# EAGLE design right_revision1_0 (EAGLE 7.2.0)
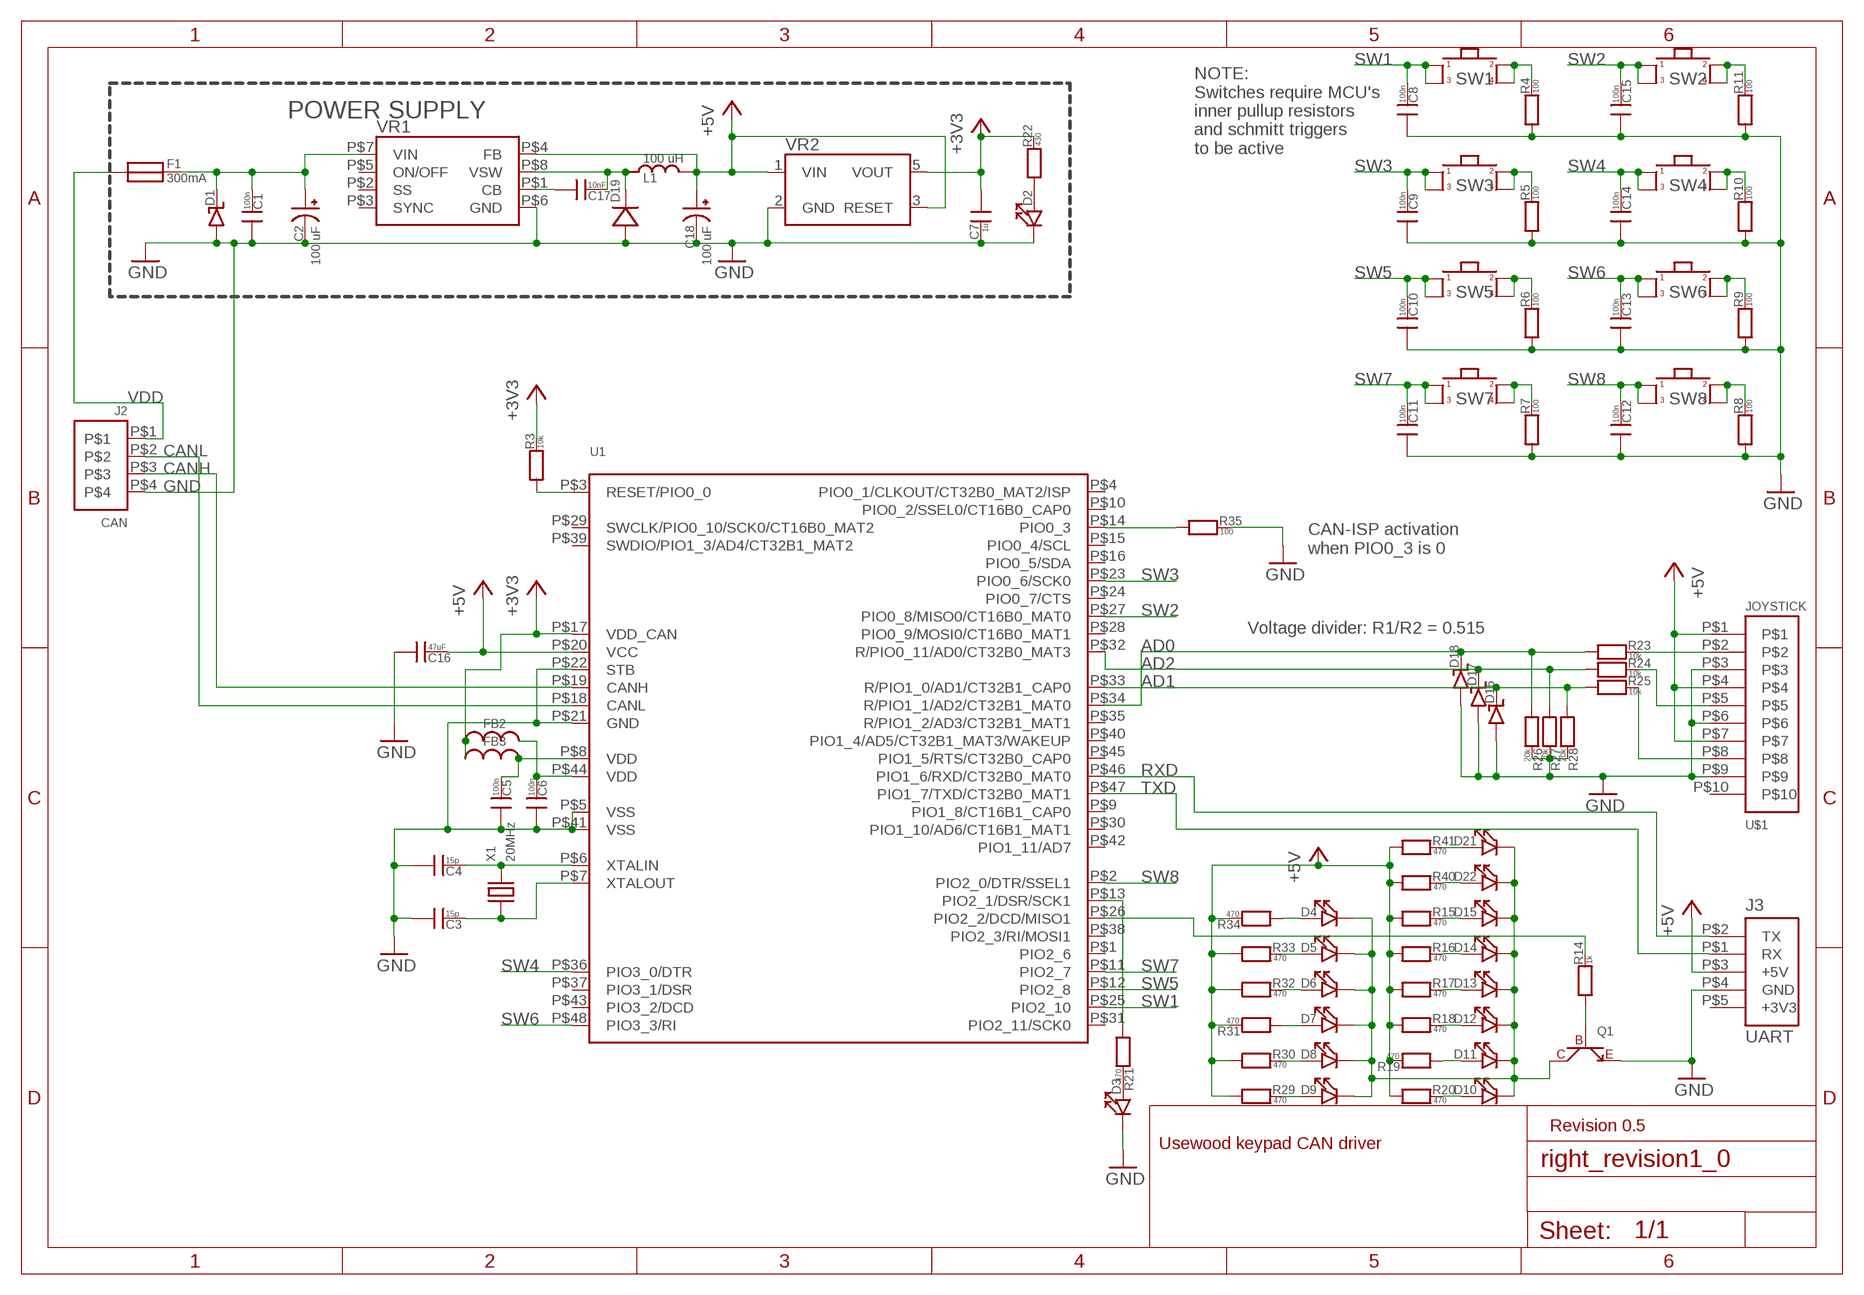
[diagram p0: schematic, sheet 1]

## Parts
C1  100n  CAP0603_SILKSCREEN  [0603_SILKSCREEN]
C2  100 uF  CAP_POLSMD_10X10X10MM  [CAP_POL_SMD_10X10X10MM]
C3  15p  CAP0603_SILKSCREEN  [0603_SILKSCREEN]
C4  15p  CAP0603_SILKSCREEN  [0603_SILKSCREEN]
C5  100n  CAP0603_SILKSCREEN  [0603_SILKSCREEN]
C6  100n  CAP0603_SILKSCREEN  [0603_SILKSCREEN]
C7  1u  CAP0603_SILKSCREEN  [0603_SILKSCREEN]
C8  100n  CAP0603_SILKSCREEN  [0603_SILKSCREEN]
C9  100n  CAP0603_SILKSCREEN  [0603_SILKSCREEN]
C10  100n  CAP0603_SILKSCREEN  [0603_SILKSCREEN]
C11  100n  CAP0603_SILKSCREEN  [0603_SILKSCREEN]
C12  100n  CAP0603_SILKSCREEN  [0603_SILKSCREEN]
C13  100n  CAP0603_SILKSCREEN  [0603_SILKSCREEN]
C14  100n  CAP0603_SILKSCREEN  [0603_SILKSCREEN]
C15  100n  CAP0603_SILKSCREEN  [0603_SILKSCREEN]
C16  47uF  CAP0603_SILKSCREEN  [0603_SILKSCREEN]
C17  10nF  CAP0603_SILKSCREEN  [0603_SILKSCREEN]
C18  100 uF  CAP_POLSMD_10X10X10MM  [CAP_POL_SMD_10X10X10MM]
D1  DIODE_TVSDO-214AA  [DO-214AB]
D2  LED0603_SILKSCREEN  [0603_SILKSCREEN]
D3  LED0603_SILKSCREEN  [0603_SILKSCREEN]
D4  LED0603_SILKSCREEN  [0603_SILKSCREEN]
D5  LED0603_SILKSCREEN  [0603_SILKSCREEN]
D6  LED0603_SILKSCREEN  [0603_SILKSCREEN]
D7  LED0603_SILKSCREEN  [0603_SILKSCREEN]
D8  LED0603_SILKSCREEN  [0603_SILKSCREEN]
D9  LED0603_SILKSCREEN  [0603_SILKSCREEN]
D10  LED0603_SILKSCREEN  [0603_SILKSCREEN]
D11  LED0603_SILKSCREEN  [0603_SILKSCREEN]
D12  LED0603_SILKSCREEN  [0603_SILKSCREEN]
D13  LED0603_SILKSCREEN  [0603_SILKSCREEN]
D14  LED0603_SILKSCREEN  [0603_SILKSCREEN]
D15  LED0603_SILKSCREEN  [0603_SILKSCREEN]
D16  DIODE_ZENERSDO123  [SOD123]
D17  DIODE_ZENERSDO123  [SOD123]
D18  DIODE_ZENERSDO123  [SOD123]
D19  DIODEDO219AB  [DO219AB]
D21  LED0603_SILKSCREEN  [0603_SILKSCREEN]
D22  LED0603_SILKSCREEN  [0603_SILKSCREEN]
F1  300mA  FUSE100MA  [FUSE_100MA]
FB2  FERRITE0603_SILKSCREEN  [0603_SILKSCREEN]
FB3  FERRITE0603_SILKSCREEN  [0603_SILKSCREEN]
J2  CAN  MOLEX_MICRO-FIT_4WAYTH  [MOLEX_MICRO-FIT_4WAY]
J3  UART  HEADER_USARTTH  [HEADER5_1]
L1  100 uH  INDUCTORBOURNS_10X13X5MM  [INDUCTOR_BOURNS_10X13X5MM]
Q1  NPN_TRANSISTORSOT323  [SOT323]
R3  10k  RES0604_SILKSCREEN  [0603_SILKSCREEN]
R4  100  RES0604_SILKSCREEN  [0603_SILKSCREEN]
R5  100  RES0604_SILKSCREEN  [0603_SILKSCREEN]
R6  100  RES0604_SILKSCREEN  [0603_SILKSCREEN]
R7  100  RES0604_SILKSCREEN  [0603_SILKSCREEN]
R8  100  RES0604_SILKSCREEN  [0603_SILKSCREEN]
R9  100  RES0604_SILKSCREEN  [0603_SILKSCREEN]
R10  100  RES0604_SILKSCREEN  [0603_SILKSCREEN]
R11  100  RES0604_SILKSCREEN  [0603_SILKSCREEN]
R14  1k  RES0604_SILKSCREEN  [0603_SILKSCREEN]
R15  470  RES0604_SILKSCREEN  [0603_SILKSCREEN]
R16  470  RES0604_SILKSCREEN  [0603_SILKSCREEN]
R17  470  RES0604_SILKSCREEN  [0603_SILKSCREEN]
R18  470  RES0604_SILKSCREEN  [0603_SILKSCREEN]
R19  470  RES0604_SILKSCREEN  [0603_SILKSCREEN]
R20  470  RES0604_SILKSCREEN  [0603_SILKSCREEN]
R21  470  RES0604_SILKSCREEN  [0603_SILKSCREEN]
R22  430  RES0604_SILKSCREEN  [0603_SILKSCREEN]
R23  10k  RES0604_SILKSCREEN  [0603_SILKSCREEN]
R24  10k  RES0604_SILKSCREEN  [0603_SILKSCREEN]
R25  10k  RES0604_SILKSCREEN  [0603_SILKSCREEN]
R26  20k  RES0604_SILKSCREEN  [0603_SILKSCREEN]
R27  20k  RES0604_SILKSCREEN  [0603_SILKSCREEN]
R28  20k  RES0604_SILKSCREEN  [0603_SILKSCREEN]
R29  470  RES0604_SILKSCREEN  [0603_SILKSCREEN]
R30  470  RES0604_SILKSCREEN  [0603_SILKSCREEN]
R31  470  RES0604_SILKSCREEN  [0603_SILKSCREEN]
R32  470  RES0604_SILKSCREEN  [0603_SILKSCREEN]
R33  470  RES0604_SILKSCREEN  [0603_SILKSCREEN]
R34  470  RES0604_SILKSCREEN  [0603_SILKSCREEN]
R35  100  RES0604_SILKSCREEN  [0603_SILKSCREEN]
R40  470  RES0604_SILKSCREEN  [0603_SILKSCREEN]
R41  470  RES0604_SILKSCREEN  [0603_SILKSCREEN]
SW1  SWITCH12X12MM_CENTER_HOLE  [SWITCH_12X12MM_CENTER_HOLE]
SW2  SWITCH12X12MM_CENTER_HOLE  [SWITCH_12X12MM_CENTER_HOLE]
SW3  SWITCH12X12MM_CENTER_HOLE  [SWITCH_12X12MM_CENTER_HOLE]
SW4  SWITCH12X12MM_CENTER_HOLE  [SWITCH_12X12MM_CENTER_HOLE]
SW5  SWITCH12X12MM_CENTER_HOLE  [SWITCH_12X12MM_CENTER_HOLE]
SW6  SWITCH12X12MM_CENTER_HOLE  [SWITCH_12X12MM_CENTER_HOLE]
SW7  SWITCH12X12MM_CENTER_HOLE  [SWITCH_12X12MM_CENTER_HOLE]
SW8  SWITCH12X12MM_CENTER_HOLE  [SWITCH_12X12MM_CENTER_HOLE]
U1  LPC11C22QFP48  [QFP48]
U$1  JOYSTICK  MOLEX_MICRO-FIT_10WAYTH  [MOLEX-MICRO-FIT_10WAY]
VR1  LM2671SOIC8  [SOIC8]
VR2  LP2985SOP5  [SOP5]
X1  20MHz  XTALSMD_5X3.2  [XTAL_SMD_5X3.2]

## Nets
+3V3: C7.0 FB2.0 FB3.0 R3.1 R22.1 U1.P$17(VDD_CAN) VR2.5(VOUT)
+5V: C16.1 C18.+ J3.P$3(+5V) L1.P$2 R15.0 R16.0 R17.0 R18.0 R19.1 R20.0 R29.0 R30.0 R31.1 R32.0 R33.0 R34.1 R40.0 R41.0 U1.P$20(VCC) U$1.P$1 U$1.P$4 U$1.P$7 VR1.P$4(FB) VR2.1(VIN) VR2.3(RESET)
AD0: D18.P$2(N) R23.0 R26.0 U1.P$34(R/PIO1_1/AD2/CT32B1_MAT0)
AD1: D16.P$2(N) R25.0 R28.0 U1.P$33(R/PIO1_0/AD1/CT32B1_CAP0)
AD2: D17.P$2(N) R24.0 R27.0 U1.P$32(R/PIO0_11/AD0/CT32B0_MAT3)
CAN_ISP: R35.0 U1.P$14(PIO0_3)
CANH: J2.P$3 U1.P$19(CANH)
CANL: J2.P$2 U1.P$18(CANL)
GND: C1.0 C2.- C3.0 C4.0 C5.0 C6.0 C7.1 C8.0 C9.0 C10.0 C11.0 C12.0 C13.0 C14.0 C15.0 C16.0 C18.- D1.P$1(P) D2.1 D3.1 D16.P$1(P) D17.P$1(P) D18.P$1(P) D19.P$1(P) J2.P$4 J3.P$4(GND) Q1.R(E) R4.0 R5.0 R6.0 R7.0 R8.0 R9.0 R10.0 R11.0 R26.1 R27.1 R28.1 R35.1 U1.P$5(VSS) U1.P$21(GND) U1.P$22(STB) U1.P$41(VSS) U$1.P$3 U$1.P$6 U$1.P$9 VR1.P$6(GND) VR2.2(GND)
LED3: D3.0 R21.1
LED4: D4.0 R34.0
LED5: D5.0 R33.1
LED6: D6.0 R32.1
LED7: D7.0 R31.0
LED8: D8.0 R30.1
LED9: D9.0 R29.1
N$1: C1.1 C2.+ D1.P$2(N) F1.P$2 VR1.P$7(VIN)
N$2: C6.1 FB2.1 U1.P$44(VDD)
N$3: D2.0 R22.0
N$4: C17.1 D19.P$2(N) L1.P$1 VR1.P$8(VSW)
N$5: R14.1 U1.P$26(PIO2_2/DCD/MISO1)
N$6: R21.0 U1.P$13(PIO2_1/DSR/SCK1)
N$12: R4.1 SW1.P$3 SW1.P$4
N$13: R5.1 SW3.P$3 SW3.P$4
N$14: R6.1 SW5.P$3 SW5.P$4
N$15: R11.1 SW2.P$3 SW2.P$4
N$16: R9.1 SW6.P$3 SW6.P$4
N$17: R10.1 SW4.P$3 SW4.P$4
N$18: R8.1 SW8.P$3 SW8.P$4
N$19: R7.1 SW7.P$3 SW7.P$4
N$20: D15.0 R15.1
N$21: D14.0 R16.1
N$22: D13.0 R17.1
N$23: D12.0 R18.1
N$24: D11.0 R19.0
N$25: D10.0 R20.1
N$26: C5.1 FB3.1 U1.P$8(VDD)
N$27: C17.0 VR1.P$1(CB)
N$29: D21.0 R41.1
N$30: D22.0 R40.1
N$31: D4.1 D5.1 D6.1 D7.1 D8.1 D9.1 D10.1 D11.1 D12.1 D13.1 D14.1 D15.1 D21.1 D22.1 Q1.M(C)
Q1: Q1.L(B) R14.0
RESET: R3.0 U1.P$3(RESET/PIO0_0)
RXD: J3.P$2(TX) U1.P$46(PIO1_6/RXD/CT32B0_MAT0)
SW1: C8.1 SW1.P$1 SW1.P$2 U1.P$25(PIO2_10)
SW2: C15.1 SW2.P$1 SW2.P$2 U1.P$27(PIO0_8/MISO0/CT16B0_MAT0)
SW3: C9.1 SW3.P$1 SW3.P$2 U1.P$23(PIO0_6/SCK0)
SW4: C14.1 SW4.P$1 SW4.P$2 U1.P$36(PIO3_0/DTR)
SW5: C10.1 SW5.P$1 SW5.P$2 U1.P$12(PIO2_8)
SW6: C13.1 SW6.P$1 SW6.P$2 U1.P$48(PIO3_3/RI)
SW7: C11.1 SW7.P$1 SW7.P$2 U1.P$11(PIO2_7)
SW8: C12.1 SW8.P$1 SW8.P$2 U1.P$2(PIO2_0/DTR/SSEL1)
TXD: J3.P$1(RX) U1.P$47(PIO1_7/TXD/CT32B0_MAT1)
VDD: F1.P$1 J2.P$1
XJOY: R23.1 U$1.P$2
XTALIN: C4.1 U1.P$6(XTALIN) X1.P$2
XTALOUT: C3.1 U1.P$7(XTALOUT) X1.P$1
YJOY: R24.1 U$1.P$5
ZJOY: R25.1 U$1.P$8
Unconnected: J3.P$5(+3V3) U1.P$1(PIO2_6) U1.P$4(PIO0_1/CLKOUT/CT32B0_MAT2/ISP) U1.P$9(PIO1_8/CT16B1_CAP0) U1.P$10(PIO0_2/SSEL0/CT16B0_CAP0) U1.P$15(PIO0_4/SCL) U1.P$16(PIO0_5/SDA) U1.P$24(PIO0_7/CTS) U1.P$28(PIO0_9/MOSI0/CT16B0_MAT1) U1.P$29(SWCLK/PIO0_10/SCK0/CT16B0_MAT2) U1.P$30(PIO1_10/AD6/CT16B1_MAT1) U1.P$31(PIO2_11/SCK0) U1.P$35(R/PIO1_2/AD3/CT32B1_MAT1) U1.P$37(PIO3_1/DSR) U1.P$38(PIO2_3/RI/MOSI1) U1.P$39(SWDIO/PIO1_3/AD4/CT32B1_MAT2) U1.P$40(PIO1_4/AD5/CT32B1_MAT3/WAKEUP) U1.P$42(PIO1_11/AD7) U1.P$43(PIO3_2/DCD) U1.P$45(PIO1_5/RTS/CT32B0_CAP0) U$1.P$10 VR1.P$2(SS) VR1.P$3(SYNC) VR1.P$5(ON/OFF)

## Notes on the sheet
- POWER SUPPLY
- NOTE:
  Switches require MCU's
  inner pullup resistors
  and schmitt triggers
  to be active
- CAN-ISP activation 
  when PIO0_3 is 0
- Voltage divider: R1/R2 = 0.515
- Revision 0.5
- Usewood keypad CAN driver

## Library data of the parts
C1 C3-C17 = usevolt:CAP
C2 C18 = usevolt:CAP_POL
D1 = arm:DIODE_TVS
D2-D15 D21 D22 = usevolt:LED
D16-D18 = usevolt:DIODE_ZENER
D19 = usevolt:DIODE
F1 = arm:FUSE
FB2 FB3 = usevolt:FERRITE
J2 = arm:MOLEX_MICRO-FIT_4WAY: MOLEX 43045-0401 HEADER, RIGHT ANGLE, DUAL ROW, 4 WAY, 1704306
J3 = arm:HEADER_USART: USB to USART module header
L1 = usevolt:INDUCTOR
Q1 = usevolt:NPN_TRANSISTOR: http://www.farnell.com/datasheets/1697409.pdf 9294511
R3-R11 R14-R35 R40 R41 = usevolt:RES
SW1-SW8 = arm:SWITCH
U1 = arm:LPC11C22: NXP MCU, 32BIT, CORTEX-M0, 50MHZ, LQFP-48, 2314753
U$1 = usevolt:MOLEX_MICRO-FIT_10WAY: MOLEX HEADER, MICRO-FIT, R/A, DUAL ROW, 10 WAY, 1012255
VR1 = usevolt:LM2671
VR2 = arm:LP2985: TEXAS INSTRUMENTS LP2985IM5-3.3 V REG LDO +3.3V, SMD, 2985, SOT235
X1 = arm:XTAL

## Board
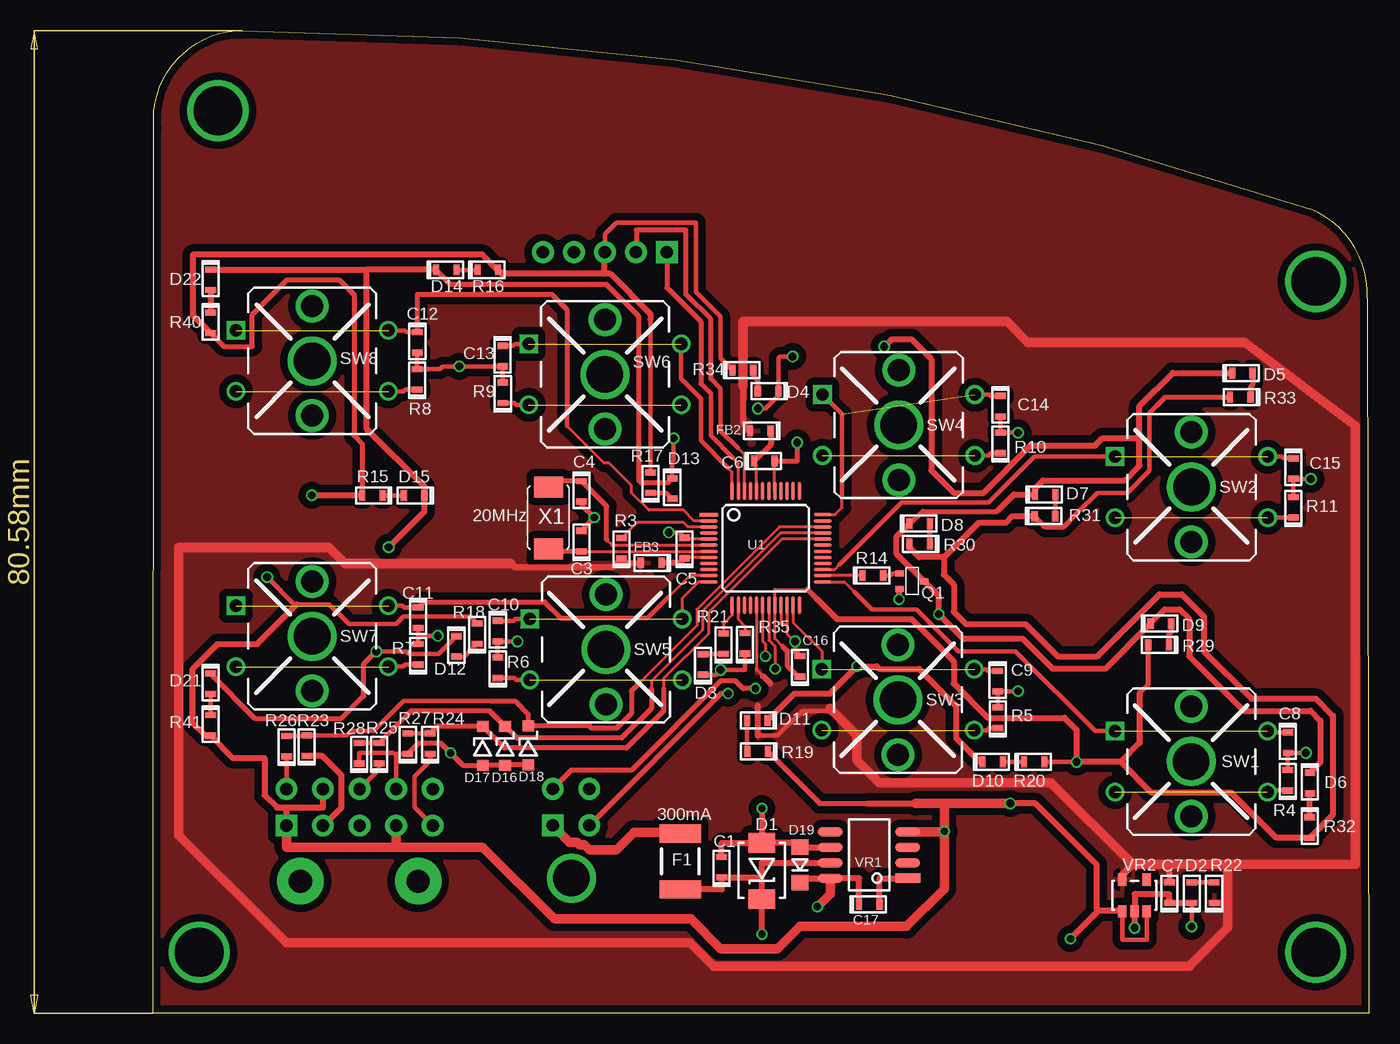
[diagram p1: board, top side]
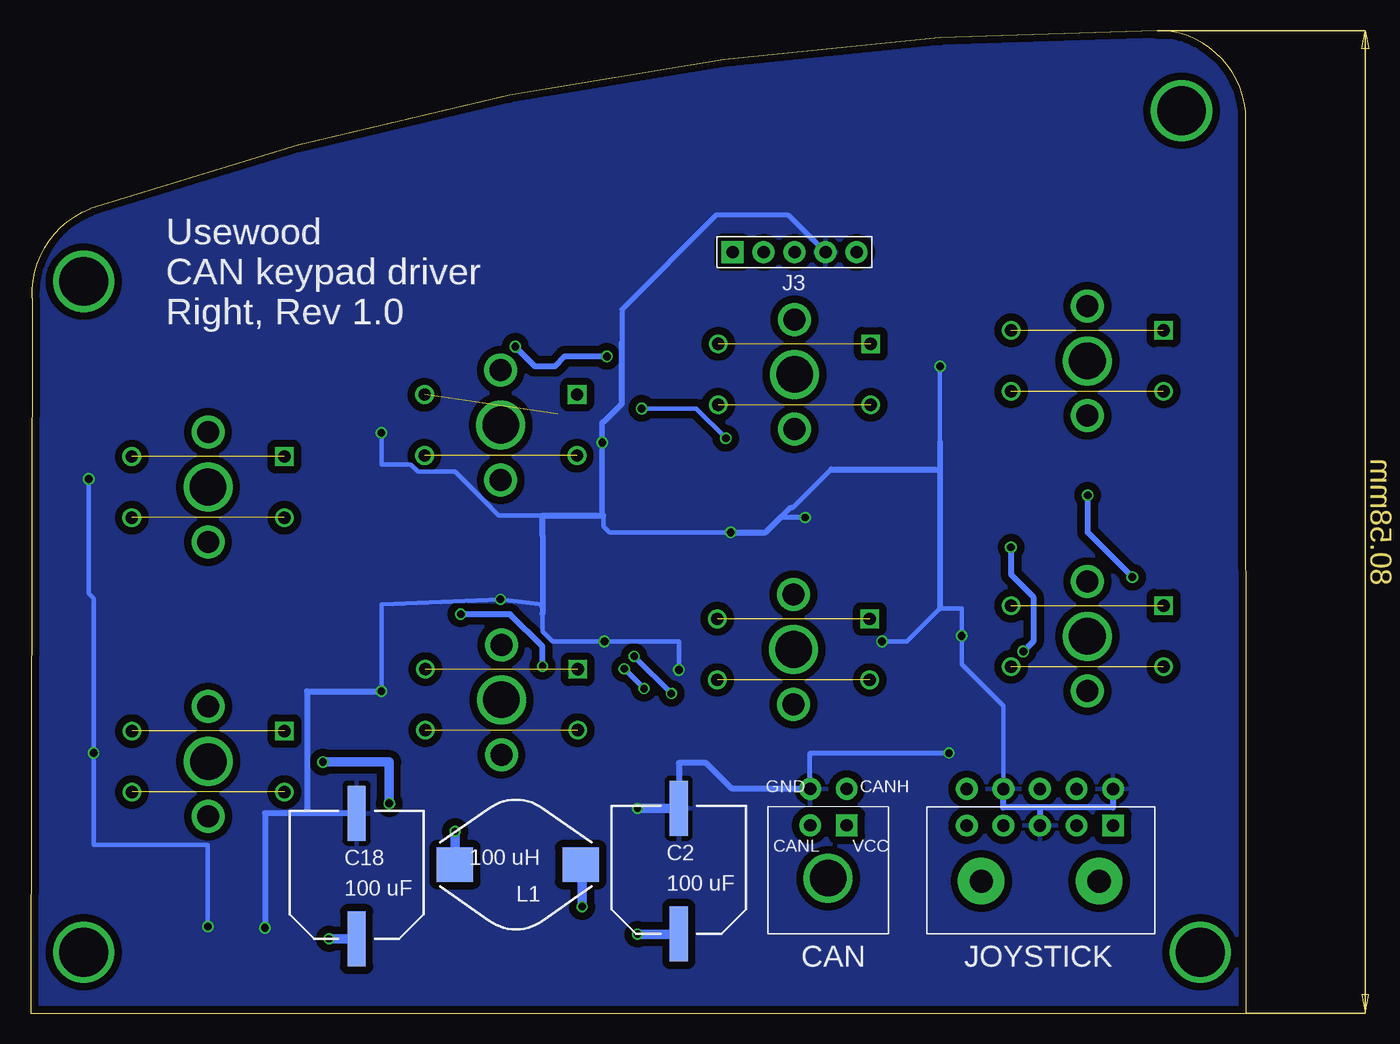
[diagram p2: board, bottom side, seen from below]

Size 99.68 x 80.58 mm. Coordinates in mm from the lower left corner, seen from the top.
Outline: 0,0 0.05,72.6 arc-90 6.81,80.58 7.31,80.58 arc-19 94.8,65.97 arc-71 99.54,58.64 99.68,0 0,0
Copper layers (1*16): Top 0.035mm / dielectric 1.5mm / Bottom 0.035mm
Design rules "SeeedStudio_2layer_DRU_no_angle_20140221 *": minimum track width 6mil, minimum drill 12mil, track to track 6mil, track to pad 6mil, pad to pad 6mil, via to via 6mil, smd to smd 0mil, copper to edge 10mil, drill to drill 10mil, minimum pad ring 10mil, minimum via ring 6mil, stop-mask expansion 2mil, vias tented up to drill 100mil, thermal gap 16mil

### Footprints (pad centres in the part's own frame; a part is rotated, then mirrored left to right if it is on the bottom)
0603_SILKSCREEN = smd 0.508 x 0.889: 0 -1.041,0; 1 0.648,0
CAP_POL_SMD_10X10X10MM = smd 1.5 x 4.5: + 0,0; - 0,10.3
DO-214AB = smd 1.62 x 2.18: P$1 0,0; P$2 4.6,0
SOD123 = smd 0.9 x 0.95: P$1 0,0; P$2 3.2,0
DO219AB = smd 1.3 x 1.4: P$1 0,0; P$2 2.9,0
FUSE_100MA = smd 1.5 x 3.41: P$1 0,0; P$2 4.572,0
MOLEX_MICRO-FIT_4WAY = drill 1.016 pad 1.778 square: P$1 1.27,2.032 | drill 1.016 pad 1.778: P$2 -1.727,2.032; P$3 1.27,5.029; P$4 -1.727,5.029 | drill 3: P$5 -0.25,-2.3
HEADER5_1 = drill 1.016 pad 1.778 square: P$1 0,0 | drill 1.016 pad 1.778: P$2 0,-2.54; P$3 0,-5.08; P$4 0,-7.62; P$5 0,-10.16
INDUCTOR_BOURNS_10X13X5MM = smd 3 x 2.8: P$1 -1.5,0; P$2 8.8,0
SOT323 = smd 0.5 x 0.7: L 0,0; M 0.63,2; R 1.27,0
SWITCH_12X12MM_CENTER_HOLE = drill 1.016 square: P$1 -3,4.75 | drill 1.016: P$2 9.5,4.75; P$3 -3,-0.25; P$4 9.5,-0.25 | drill 3 pad 2.9: P$5 3.25,2.25 | drill 1.8 pad 1.7: P$10 3.25,6.75; P$11 3.25,-2.25
QFP48 = smd 1.5 x 0.28: P$1 0.2,0; P$2 0.2,-0.5; P$3 0.2,-1; P$4 0.2,-1.5; P$5 0.2,-2; P$6 0.2,-2.5; P$7 0.2,-3; P$8 0.2,-3.5; P$9 0.2,-4; P$10 0.2,-4.5; P$11 0.2,-5; P$12 0.2,-5.5; P$25 9.55,-5.5; P$26 9.55,-5; P$27 9.55,-4.5; P$28 9.55,-4; P$29 9.55,-3.5; P$30 9.55,-3; P$31 9.55,-2.5; P$32 9.55,-2; P$33 9.55,-1.5; P$34 9.55,-1; P$35 9.55,-0.5; P$36 9.55,0 | smd 0.28 x 1.5: P$13 2.125,-7.425; P$14 2.625,-7.425; P$15 3.125,-7.425; P$16 3.625,-7.425; P$17 4.125,-7.425; P$18 4.625,-7.425; P$19 5.125,-7.425; P$20 5.625,-7.425; P$21 6.125,-7.425; P$22 6.625,-7.425; P$23 7.125,-7.425; P$24 7.625,-7.425; P$37 7.625,1.925; P$38 7.125,1.925; P$39 6.625,1.925; P$40 6.125,1.925; P$41 5.625,1.925; P$42 5.125,1.925; P$43 4.625,1.925; P$44 4.125,1.925; P$45 3.625,1.925; P$46 3.125,1.925; P$47 2.625,1.925; P$48 2.125,1.925
MOLEX-MICRO-FIT_10WAY = drill 1.016 pad 1.778 square: P$1 0,-0.508 | drill 1.016 pad 1.778: P$2 -2.997,-0.508; P$3 -5.994,-0.508; P$4 -8.992,-0.508; P$5 -11.989,-0.508; P$6 0,2.489; P$7 -2.997,2.489; P$8 -5.994,2.489; P$9 -8.992,2.489; P$10 -11.989,2.489 | drill 1.905 pad 3.81: P$11 -10.795,-5.08; P$12 -1.143,-5.08
SOIC8 = smd 2.032 x 0.762: P$1 -2.54,2.54; P$2 -2.54,1.27; P$3 -2.54,0; P$4 -2.54,-1.27; P$5 3.81,-1.27; P$6 3.81,0; P$7 3.81,1.27; P$8 3.81,2.54
SOP5 = smd 0.7 x 1: 1 -1,0; 2 0,0; 3 1,0; 4 1,2.6; 5 -1,2.6
XTAL_SMD_5X3.2 = smd 1.7 x 2.4: P$1 -2.54,0; P$2 2.54,0

### Placement (x,y rotation side)
C1  46.6,11.78 270 top
C2  46.53,6.5 0 bottom
C3  35.12,38.52 270 top
C4  35.13,42.99 90 top
C5  43.56,37.95 270 top
C6  49.91,45.28 180 top
C7  83.31,9.71 270 top
C8  93.04,22.39 90 top
C9  69.24,27.41 90 top
C10  28.26,31.53 90 top
C11  21.71,32.63 90 top
C12  21.66,55.19 90 top
C13  28.66,54.07 90 top
C14  69.47,49.97 90 top
C15  93.48,44.85 90 top
C16  53.03,28.24 270 top
C17  58.52,8.94 180 top
C18  72.95,6.1 0 bottom
D1  49.9,13.97 270 top
D2  85.14,9.7 270 top
D3  45.07,28.4 270 top
D4  50.61,51.01 0 top
D5  89.1,52.5 180 top
D6  94.84,19.07 90 top
D7  72.94,42.53 180 top
D8  62.66,40.15 180 top
D9  82.42,31.94 180 top
D10  68.63,20.61 180 top
D11  49.73,24.01 0 top
D12  24.86,30.27 90 top
D13  42.56,43.22 90 top
D14  23.85,60.95 180 top
D15  21.59,42.45 0 top
D16  28.85,20.32 90 top
D17  27.03,20.32 90 top
D18  30.76,20.35 90 top
D19  53.03,13.61 270 top
D21  4.71,27.21 90 top
D22  4.71,60.33 90 top
F1  43.22,14.73 270 top
FB2  49.99,47.75 0 top
FB3  41.02,36.93 0 top
J2  34.04,13.37 0 bottom
J3  42.12,62.4 90 bottom
L1  56.08,12.19 180 bottom
Q1  61.22,36.05 270 top
R3  38.42,37.93 270 top
R4  93.04,18.9 270 top
R5  69.25,24.03 270 top
R6  28.26,28.13 270 top
R7  21.72,29.23 270 top
R8  21.65,51.79 270 top
R9  28.67,50.69 270 top
R10  69.46,46.57 270 top
R11  93.48,41.28 270 top
R14  58.81,35.88 180 top
R15  18.18,42.46 0 top
R16  27.25,60.95 180 top
R17  40.77,43.3 270 top
R18  26.55,30.93 270 top
R19  49.75,21.47 0 top
R20  72.04,20.61 180 top
R21  46.75,30.09 270 top
R22  86.98,9.7 270 top
R23  12.6,21.74 270 top
R24  22.72,21.91 270 top
R25  18.53,21.13 270 top
R26  10.94,21.7 270 top
R27  20.88,21.91 270 top
R28  16.88,21.12 270 top
R29  82.62,30.2 0 top
R30  63.04,38.48 0 top
R31  72.92,40.75 180 top
R32  94.84,15.43 90 top
R33  89.33,50.52 0 top
R34  48.16,52.72 180 top
R35  48.54,30.13 270 top
R40  4.71,56.8 90 top
R41  4.71,23.8 90 top
SW1  81.86,18.39 0 top
SW2  81.88,40.89 0 top
SW3  57.83,23.44 0 top
SW4  57.88,45.97 0 top
SW5  33.87,27.58 0 top
SW6  33.8,50.13 0 top
SW7  9.79,28.66 0 top
SW8  9.79,51.24 0 top
U1  45.35,40.88 0 top
U$1  10.93,15.9 0 bottom
VR1  59.33,13.61 180 top
VR2  80.46,8.36 0 top
X1  32.42,40.61 90 top

### Tracks (layer width: path | path; a pad name or v marks a point on that pad's centre or on a via)
+3V3
  Top 0.254: U1.P$17 49.48,31.59 49.45,31.42 49.45,28.17 | 49.45,28.17 49.45,28.14 | 49.99,27.64 49.45,28.17
  Top 0.381: 55.47,24.99 55.27,24.79 53.24,24.79 51.21,22.76 49.58,22.76
  Top 0.508: R22.1 88.12,9.05 | 83.29,12.2 C7.0 | 48.36,51.41 48.36,48.34 FB2.0 | 50.6,27.03 49.99,27.64 | 29.36,36.88 29.67,36.58 37.71,36.58 R3.1 38.77,36.93 FB3.0 | 49.58,22.76 49.58,25.2
  Top 0.635: VR2.5 79.46,11.35 80.31,12.2
  Top 0.762: 88.12,12.2 88.12,9.05 88.12,7.04 84.94,3.86 45.92,3.86 44.01,5.78 10.93,5.78 2.11,14.6 2.11,38.2 14.43,38.2 15.75,36.88 29.36,36.88 | 88.12,12.2 83.29,12.2 80.31,12.2 73.61,18.9 59.54,18.9 57.71,20.73 57.71,22.76 55.47,24.99 | 88.12,12.2 98.55,12.2 98.55,48.2 89.51,55 71.71,55 70.02,56.69 48.36,56.69 48.36,51.41
  pour Top (isolate 0.61): 99.68,0 98.83,55.38 arc41 98.87,61.57 arc28 95.09,65.57 arc9 87.31,68.37 arc-1 70.51,73.18 arc5 53.71,76.78 arc6 25.71,79.98 arc3 8.91,80.58 arc1 6.51,80.58 arc15 5.11,80.38 arc5 2.71,79.58 arc27 0.11,77.78 arc39 0.15,72.8 0,0
+5V  (via drill 0.6, 0.64)
  Top 0.254: 53.64,34.75 50.98,34.75 U1.P$20 50.98,30.71 51.61,30.07
  Top 0.381: VR2.1 79.46,6 81.46,6 VR2.3 | 28.28,60.95 28.36,60.87 28.36,60.88 R16.0 | 75.71,40.96 77.42,42.67 79.86,42.67 81.69,44.5 81.69,49.23 82.32,49.86 | R20.0 v75.71,20.6 | 40.77,56.9 R17.0 | R18.0 26.01,32.51 20.52,32.51 19.91,31.9 16.05,31.9 14.43,33.53 11.79,33.53 11.58,33.53 v9.35,35.76 | 4.27,22.76 R41.0 | 13.01,42.46 v13,42.47 | 72.3,40.95 R31.1 | J3.P$3 37.04,63.87 38,64.82 44.5,64.82 44.5,59.13 46.53,57.1 46.53,53.7 R34.1
  Top 0.406: 72.34,17.2 72.31,17.2 | C16.1 52.87,27.6 52.02,28.45 52.02,29.67 51.61,30.07 | R19.1 54.66,17.2 58.59,17.2 | 75.71,40.96 74.57,39.83 73.15,39.83 72.27,40.71 R31.1 | 80.87,26.26 81.58,26.96 R29.0 | 82.32,49.86 82.98,50.52 R33.0 | R40.0 5.81,54.66 8.13,54.66 8.13,57.3 10.97,60.15 15.24,60.15 16.46,58.93 16.46,47.35 17.14,46.66 R15.0 | 53.64,34.75 54.46,33.93
  Top 0.508: VR2.1 79.46,8.4 77.51,8.4 | 28.36,60.87 28.6,60.62 36.98,60.62 | 40.77,56.9 40.77,57.34 37.49,60.62 36.98,60.62 | 72.34,17.2 77.34,12.19 77.34,8.57 77.51,8.4 | 72.31,17.2 v70.28,17.2 | U$1.P$1 10.93,16.87 | 10.93,16.87 13.93,16.87 U$1.P$7 | U$1.P$4 | R41.0 6.54,20.93 9.14,20.93 9.14,17.88 10.16,16.87 10.93,16.87 | 58.59,17.2 62.51,17.2 | 80.87,26.26 80.87,22.15 79.32,20.6 | 79.32,20.6 v75.71,20.6 75.71,23.25 74.73,24.23 68.43,24.23 65.63,27.03 65.63,28.85 62.18,32.31 56.08,32.31 54.46,33.93 | 4.27,22.76 3.25,23.77 3.25,28.25 5.28,30.28 8.53,30.28 11.79,33.53 | R15.0 13.01,42.46 | R16.0 28.26,60.95 27.03,62.18 3.25,62.18 3.25,57.22 R40.0 | v75.21,6.1 77.51,8.4 | J3.P$3 36.98,62.34 36.98,60.62 | R31.1 70.42,40.75 69.9,40.23 67.72,40.23 64.87,37.39 64.82,37.39 | 64.82,37.39 62.79,37.39 62,38.18 R30.0 | 79.32,20.6 81.84,18.09 88.39,18.09 92.09,14.39 R32.0 96.72,16.27 96.72,24.38 95.3,25.81 90.02,25.81 86.16,29.67 86.16,32.51 84.33,34.34 82.5,34.34 77.42,29.26 74.17,29.26 71.53,31.9 66.65,31.9 65.63,32.92 65.63,35.15 64.82,35.97 64.82,37.39
  Top 0.762: v70.28,17.2 64.82,17.2 | 64.82,17.2 62.51,17.2 | U$1.P$4 19.91,13.61 | 19.91,13.61 10.93,13.61 U$1.P$1 | v64.87,14.91 64.87,17.15 64.82,17.2 | VR1.P$4 64.85,14.88 v64.87,14.91 | v75.21,6.1 | v64.87,14.91 64.87,10.21 61.77,7.11 53.04,7.11 51.21,5.28 46.53,5.28 44.09,7.72 32.92,7.72 27.03,13.61 19.91,13.61
  Bottom 0.406: 70.28,17.22 70.28,17.27 v70.28,17.2 | 75.74,20.6 v75.71,20.6
  Bottom 0.508: v9.35,35.76 13,39.42 v13,42.47
  Bottom 0.762: U$1.P$4 | 70.28,17.27 70.28,20.6 v75.71,20.6 | v64.87,14.91 64.87,12.2 L1.P$2 | C18.+ v75.21,6.1
AD0
  Top 0.254: U1.P$34 51.33,39.88 44.58,33.12 44.58,31.77 39.83,27.03
  Top 0.381: 27.64,25.6 20.52,25.6 18.08,23.16 16.26,23.16 15.87,22.78 R23.0 12.57,22.75 R26.0
  Top 0.406: 39.83,27.03 39.22,26.42 39.22,24.59 38,23.37 35.97,23.37 35.79,23.55 D18.P$2 30.76,24.51 29.67,25.6 27.64,25.6
AD1
  Top 0.254: U1.P$33 51.44,39.38 45.06,32.99 45.06,31.45 40.84,27.23 40.84,26.62
  Top 0.381: R28.0 R25.0 20.75,24.39
  Top 0.406: 40.84,26.62 40.84,24.99 38.4,22.55 29.82,22.55 D16.P$2 27.58,24.79 21.15,24.79 20.75,24.39
AD2
  Top 0.254: U1.P$32 51.55,38.88 45.52,32.84 45.52,31.09 41.86,27.43 41.86,26.62
  Top 0.381: R24.0 R27.0
  Top 0.406: 41.86,26.62 41.86,24.79 38.81,21.74 28.8,21.74 D17.P$2 23.29,23.52 R24.0
CAN_ISP
  Top 0.254: U1.P$14 47.96,33.43 47.96,32.31 48.54,31.73 R35.0
CANH  (via drill 0.6)
  Top 0.254: U1.P$19 50.48,30.6 51,30.07 v51,28.25
  Top 0.406: v49.38,26.62 48.36,26.62 47.75,27.23 46.53,27.23 39.22,19.91 34.28,19.91 J2.P$3
  Bottom 0.406: v51,28.25 v49.38,26.62
CANL  (via drill 0.6)
  Top 0.254: U1.P$18 49.98,30.49 50.19,30.28 v50.19,29.26
  Top 0.406: v47.14,26.21 46.58,26.21 J2.P$2
  Bottom 0.406: v50.19,29.26 v47.14,26.21
GND  (via drill 0.6, 0.64)
  Top 0.254: U1.P$5 44.03,38.88 43.89,39.01 C5.0 | U1.P$22 51.98,31.9 | 51.98,31.9 51.98,31.09 v52.63,30.48 | U1.P$21 51.48,31.9 51.98,31.9 | U1.P$41 50.96,42.82 C6.0
  Top 0.381: R11.0 C15.0 94.71,43.81 v94.91,43.8 | C14.0 R10.0 v70.91,47.61 v70.91,47.6 | R5.0 69.25,26.36 C9.0 70.91,26.37 v70.91,26.4 | R9.0 C13.0 | C13.0 | C12.0 R8.0 23.54,52.83 23.75,53.04 v25.11,53.04 v25.11,53.03 C13.0 | R7.0 21.72,30.89 | 21.72,30.89 C11.0 | v94.51,21.35 C8.0 R4.0 | R35.1 48.54,28.14 v46.52,28.14 46.13,27.75 D3.1 | v42.27,39.42 43.16,39.42 C5.0 | R6.0 C10.0 28.27,30.48 v29.87,30.48 | v23.33,30.94 21.72,30.94 21.72,30.89 | R28.1 16.88,21.36 19.68,21.36 19.79,21.26 19.91,21.26 | 19.91,21.26 R27.1 | 19.91,21.26 19.91,19.82 19.92,19.81 U$1.P$9 | U$1.P$6 10.94,18.4 R26.1 | D2.1 v85.14,7.12 v85.14,7.11
  Top 0.406: D18.P$1 28.88,20.34 D16.P$1 D17.P$1 25.4,20.32 v24.38,21.34 23.57,22.15 21.77,22.15 R27.1 | C6.0 52.81,45.28 v52.81,46.79 | C3.0 35.12,39.59 v36.17,40.64 35.12,41.68 C4.0 | v52.63,30.48 52.63,29.69 C16.0
  Top 0.508: 80.47,6.98 v80.46,7 VR2.2 80.47,9.75 83.31,9.75 C7.1 84.93,9.06 D2.1 | Q1.R 61.16,34.72 v61.16,33.93 | VR1.P$6 D19.P$1 52.68,13.96 D1.P$1 | D1.P$1 46.6,13.96 C1.0 | v49.91,16.79 D1.P$1
  Bottom 0.381: 80.47,6.98 v80.47,7 v80.46,7 | v94.51,21.35 94.51,34 94.91,34.4 v94.91,43.8 | v94.51,21.35 94.51,21.26 | 25.11,46.8 v25.11,53.04 | v70.91,47.6 70.91,45 68.51,45 67.91,44.4 64.87,44.4 62.51,42.04 61.31,40.8 57.7,40.8 | 57.71,32.74 57.7,33.14 57.7,31.29 56.9,30.48 v52.63,30.48 46.52,30.48 v46.52,28.14 | 57.7,39.2 57.71,39.2 | v94.51,21.35 94.51,13.82 85.14,13.82 v85.14,7.11 | U$1.P$9 19.91,25.2 23.33,28.62 v23.33,30.94 23.33,33.2 25.11,33.2 27.83,30.48 v29.87,30.48 | 34.04,44.6 37.19,41.45 | 25.21,44.6 25.11,44.5 | v42.27,39.42 52.22,39.42 52.71,39.91 52.71,40.8 | 57.71,33.53 v61.16,33.93 70.91,33.53 v70.91,26.4
  Bottom 0.406: J2.P$4 35.76,21.34 v24.38,21.34 | v36.17,40.64 38.2,40.64 | 38.2,40.64 38.4,40.44 | 37.19,41.45 37.39,41.45 38.2,40.64 | 51.21,54.96 51.21,57.71 43.48,65.43 37.53,65.43 J3.P$4
  Bottom 0.457: 52.71,48.48 52.81,48.39 v52.81,46.79 52.81,40.9 52.71,40.8
  Bottom 0.508: 57.7,39.2 57.7,40.8 52.71,40.8 | 57.71,39.2 57.71,33.53 57.71,33.33 57.71,32.74 | 25.11,46.8 25.11,44.6 | 25.11,44.6 25.11,44.5 25.11,33.2 | 16.92,15.39 U$1.P$3 16.93,16.87 | U$1.P$6 10.93,16.87 16.93,16.87 | 16.93,16.87 19.92,16.87 U$1.P$9 | v42.27,39.42 39.42,39.42 38.4,40.44 38.09,40.75 | 52.71,48.48 51.21,49.99 51.21,54.96 | 34.04,44.6 25.11,44.6 | v70.91,26.4 77.01,26.4 77.01,16.4 | C18.- 77.01,16.4 | 77.01,16.4 80.46,16.4 v80.46,7 | C2.- 46.53,20.52 44.3,20.52 42.17,18.4 J2.P$4
  Bottom 0.762: C2.- v49.91,16.79
  pour Bottom (isolate 0.61): 99.68,0.2 98.83,55.59 arc41 98.87,61.57 arc28 95.09,65.57 arc9 87.31,68.17 arc-1 70.51,73.38 arc5 53.71,76.98 arc6 25.71,80.18 arc3 8.91,80.78 arc1 6.51,80.78 arc15 5.11,80.58 arc5 2.71,79.78 arc27 0.11,77.98 arc39 0.15,71.58 0,0.2
LED3
  Top 0.381: R21.1 D3.0
LED4
  Top 0.381: D4.0 49.58,51.02 49.58,51.82 49.2,52.2 R34.0
LED5
  Top 0.406: D5.0 90.14,51.54 89.97,51.37 R33.1
LED6
  Top 0.508: R32.1 D6.0
LED7
  Top 0.381: R31.0 73.98,40.98 D7.0
LED8
  Top 0.406: R30.1 D8.0
LED9
  Top 0.406: D9.0 83.47,31.24 83.27,31.05 R29.1
N$1  (via drill 0.6)
  Top 0.508: 49.9,11.13 D1.P$2 v49.91,6.48 | 49.9,11.13 49.9,12.34 VR1.P$7 | 49.9,11.13 C1.1 46.6,10.15 F1.P$2
  Bottom 0.508: C2.+ 46.53,6.48
  Bottom 0.762: 46.53,6.48 v49.91,6.48
N$2
  Top 0.254: U1.P$44 49.48,44.92 49.27,45.13 C6.1
  Top 0.508: FB2.1 50.64,46.65 C6.1
N$3
  Top 0.381: R22.0 D2.0
N$4  (via drill 0.6)
  Top 0.508: C17.1 57.87,11.07 VR1.P$8 53.4,11.07 D19.P$2
  Top 0.762: v54.46,8.74 55.52,9.8 VR1.P$8
  Bottom 0.762: L1.P$1 54.46,12.07 v54.46,8.74
N$5
  Top 0.254: R14.1 U1.P$26
N$6
  Top 0.254: U1.P$13 47.48,32.64 46.75,31.92 R21.0
N$7  (via drill 4)
  other vias: 3.76,5
N$8  (via drill 4)
  other vias: 95.31,5
N$9  (via drill 4)
  other vias: 95.31,60
N$10  (via drill 4)
  other vias: 5.31,74
N$12  (1 unrouted)
  Top 0.381: R4.1 91.47,18.25 SW1.P$4
N$13  (1 unrouted)
  Top 0.381: SW3.P$4 68.36,23.2 68.54,23.38 R5.1
N$14  (1 unrouted)
  Top 0.381: SW5.P$3 29.77,27.33 29.62,27.48 R6.1
  Top 0.406: SW5.P$3
N$15  (1 unrouted)
  Top 0.381: R11.1 SW2.P$4
N$16  (1 unrouted)
  Top 0.381: SW6.P$3 29.77,49.88 29.62,50.04 R9.1
N$17  (1 unrouted)
  Top 0.381: SW4.P$4 68.48,45.72 68.68,45.92 R10.1
N$18  (1 unrouted)
  Top 0.381: SW8.P$4 20.5,50.99 20.66,51.14 R8.1
  Top 0.406: SW8.P$4
N$19  (1 unrouted)
  Top 0.381: 19.3,28.43 20.5,28.43 20.65,28.58 R7.1
  Top 0.406: SW7.P$4 19.3,28.43
N$20
  Top 0.381: D15.0 20.11,42.46 R15.1
N$21
  Top 0.381: R16.1 D14.0
N$22
  Top 0.381: D13.0 42.09,42.65 R17.1
N$23
  Top 0.381: R18.1 25.5,29.23 D12.0
N$24
  Top 0.381: R19.0 48.69,21.48 D11.0
N$25
  Top 0.381: D10.0 70.28,20.61 R20.1
N$26
  Top 0.254: U1.P$8 43.56,37.38 C5.1
  Top 0.508: C5.1 43.19,36.93 FB3.1
N$27
  Top 0.508: C17.0 59.56,11.07 VR1.P$1
N$29
  Top 0.381: R41.1 D21.0
N$30
  Top 0.508: D22.0 R40.1
N$31  (via drill 0.6, 0.64)
  Top 0.381: 18.08,29.67 v18.29,29.67 20.73,29.67 20.93,29.46 23.41,29.46 D12.1 | D13.1 42.56,45.2 42.67,45.31 v42.67,47.14 | v52.43,53.85 51.41,53.85 51.26,53.7 D4.1 51.26,50.65 50.19,49.58 v49.58,49.58 | D14.1 23.18,60.97
  Top 0.406: D21.1 4.71,27.8 8.33,24.18 15.44,24.18 17.27,26.01 17.27,28.65 v18.29,29.67 | D13.1 42.17,43.48 40.03,43.48 39.83,43.69 39.83,57.1 37.19,59.74 24.41,59.74 D14.1 | D8.1 62.1,40.15 63.09,41.15 69.19,41.15 69.29,41.25
  Top 0.508: D22.1 5.08,60.97 17.51,60.97 | 17.51,60.97 17.51,47.91 22.24,43.18 D15.1 22.24,41.14 v19.3,38.2 | 69.29,41.25 70.57,42.53 D7.1 72.29,43.03 72.95,43.69 79.65,43.69 80.87,44.91 80.87,47.35 | 80.87,47.35 80.87,49.78 83.59,52.5 D5.1 | v59.94,54.66 60.55,55.27 62.18,55.27 63.8,53.65 63.8,44.5 65.63,42.67 68.07,42.67 71.93,46.53 77.22,46.53 77.83,47.14 80.67,47.14 80.87,47.35 | 23.18,60.97 17.51,60.97 | D8.1 60.96,39.1 60.96,37.67 Q1.M 64.41,34.22 v64.41,32.72 66.45,30.68 71.32,30.68 73.76,28.25 78.08,28.25 D9.1 82.95,33.12 84.12,33.12 84.94,32.31 84.94,29.26 89.41,24.79 94.89,24.79 95.71,23.98 95.71,20.58 D6.1 | D10.1 67.78,20.61 65.84,22.55 65.84,25.2 62.79,28.25 59.54,28.25 59.33,28.45 v57.71,28.45 55.47,26.21 52.59,26.21 D11.1
  Bottom 0.381: v49.58,49.58 45.11,49.58 v42.67,47.14
  Bottom 0.508: v19.3,38.2 19.3,35.97 17.47,34.14 17.47,30.48 v18.29,29.67 | v52.43,53.85 55.88,53.85 56.69,53.03 58.32,53.03 v59.94,54.66 | v57.71,28.45 57.71,30.07 60.35,32.72 v64.41,32.72
Q1
  Top 0.381: Q1.L 60.63,36.05 60.47,35.88 R14.0
RESET
  Top 0.254: U1.P$3 43.84,39.88 43.48,40.23 39.69,40.23 R3.0
RXD
  Top 0.254: U1.P$46 48.48,45.81 47.96,46.33
  Top 0.381: 47.96,46.33 46.53,47.75 46.53,51.21 45.72,52.02
  Top 0.406: J3.P$2 39.62,62.44 39.62,64.21 43.69,64.21 43.69,58.93 45.72,56.9 45.72,52.02
SW1  (1 unrouted)
  Top 0.254: U1.P$25 56.67,35.38 57.51,34.54
  Top 0.381: 57.51,34.54 58.93,33.12 62.59,33.12 66.04,29.67 70.71,29.67 77.24,23.14 SW1.P$1 | C8.1 91.46,23.04 SW1.P$2
SW2  (1 unrouted)
  Top 0.254: U1.P$27 55.89,36.38 56.29,36.78
  Top 0.381: 56.29,36.78 61.37,41.86 68.48,41.86 72.26,45.64 SW2.P$1 | C15.1 92.67,45.5 92.53,45.64 SW2.P$2
SW3  (1 unrouted)
  Top 0.254: U1.P$23 52.48,32.06 54.83,29.7 SW3.P$1
  Top 0.381: SW3.P$2 68.33,28.2 68.46,28.06 C9.1
SW4  (1 unrouted)
  Top 0.254: U1.P$36 55.91,40.88 56.49,41.45 56.49,42.27
  Top 0.381: 56.49,42.27 56.49,49.11 SW4.P$1 | SW4.P$2 68.56,50.72 68.66,50.62 C14.1
SW5  (1 unrouted)
  Top 0.254: U1.P$12 44.73,35.38 43.37,34.02 SW5.P$2
  Top 0.381: 30.79,32.33 29.69,32.33 29.54,32.18 C10.1
  Top 0.406: 30.79,32.33 30.8,32.33 SW5.P$1
SW6  (1 unrouted)
  Top 0.254: U1.P$48 47.48,44.37 47.14,44.7
  Top 0.381: 47.14,44.7 44.91,46.94 44.91,50.39 43.28,52.02 43.28,54.87 SW6.P$2 | SW6.P$1 29.68,54.88 29.53,54.72 C13.1
SW7  (1 unrouted)
  Top 0.254: U1.P$11 44.01,35.88 42.27,34.14
  Top 0.381: 42.27,34.14 40.54,32.41 34.21,32.41 | 19.31,33.43 20.41,33.43 20.57,33.28 C11.1
  Top 0.406: C11.1 22.16,33.73 32.11,33.73 33.43,32.41 34.21,32.41 | SW7.P$2 19.31,33.43
SW8  (1 unrouted)
  Top 0.254: U1.P$2 44.36,40.38 43.48,41.25 40.64,41.25 39.22,42.67 39.22,43.28 37.39,45.11 36.98,45.11 33.93,48.16
  Top 0.381: 33.93,48.16 33.93,49.38 | C12.1 20.76,55.84 20.62,55.99 SW8.P$2
  Top 0.406: 33.93,49.38 33.93,57.71 32.72,58.93 21.66,58.93 C12.1
TXD
  Top 0.254: U1.P$47 47.98,45.09 47.55,45.52
  Top 0.381: 47.55,45.52 45.72,47.35 45.72,50.8 44.91,51.61
  Top 0.406: J3.P$1 42.12,59.48 44.91,56.69 44.91,51.61
VDD
  Top 0.762: J2.P$1 34.14,14.02 34.75,14.02 34.95,13.82 35.36,13.82 35.76,13.41 38,13.41 39.42,14.83 43.11,14.83 F1.P$1
XJOY
  Top 0.508: U$1.P$2 13.97,15.39 15.44,16.87 15.44,19.51 13.86,21.09 R23.1
XTALIN
  Top 0.254: U1.P$6 37.62,38.38 37.19,38.81
  Top 0.406: 37.19,38.81 37.19,41.57 C4.1 32.9,43.63 X1.P$2
XTALOUT
  Top 0.254: U1.P$7 C3.1
  Top 0.406: C3.1 32.62,37.87 X1.P$1
YJOY
  Top 0.381: 22.72,20.69 21.44,19.41 21.44,16.88 U$1.P$5
  Top 0.406: R24.1 22.72,20.69
ZJOY
  Top 0.381: U$1.P$8 18.53,19.99 R25.1

### Text on the board
bPlace: Usewood / CAN keypad driver / Right, Rev 1.0 | CANH | GND | VCC | CANL | JOYSTICK | CAN